# Altium schematic sheet INPUT_PWR_SW.SchDoc
size B; SheetNumber: 7; SheetTotal: 13
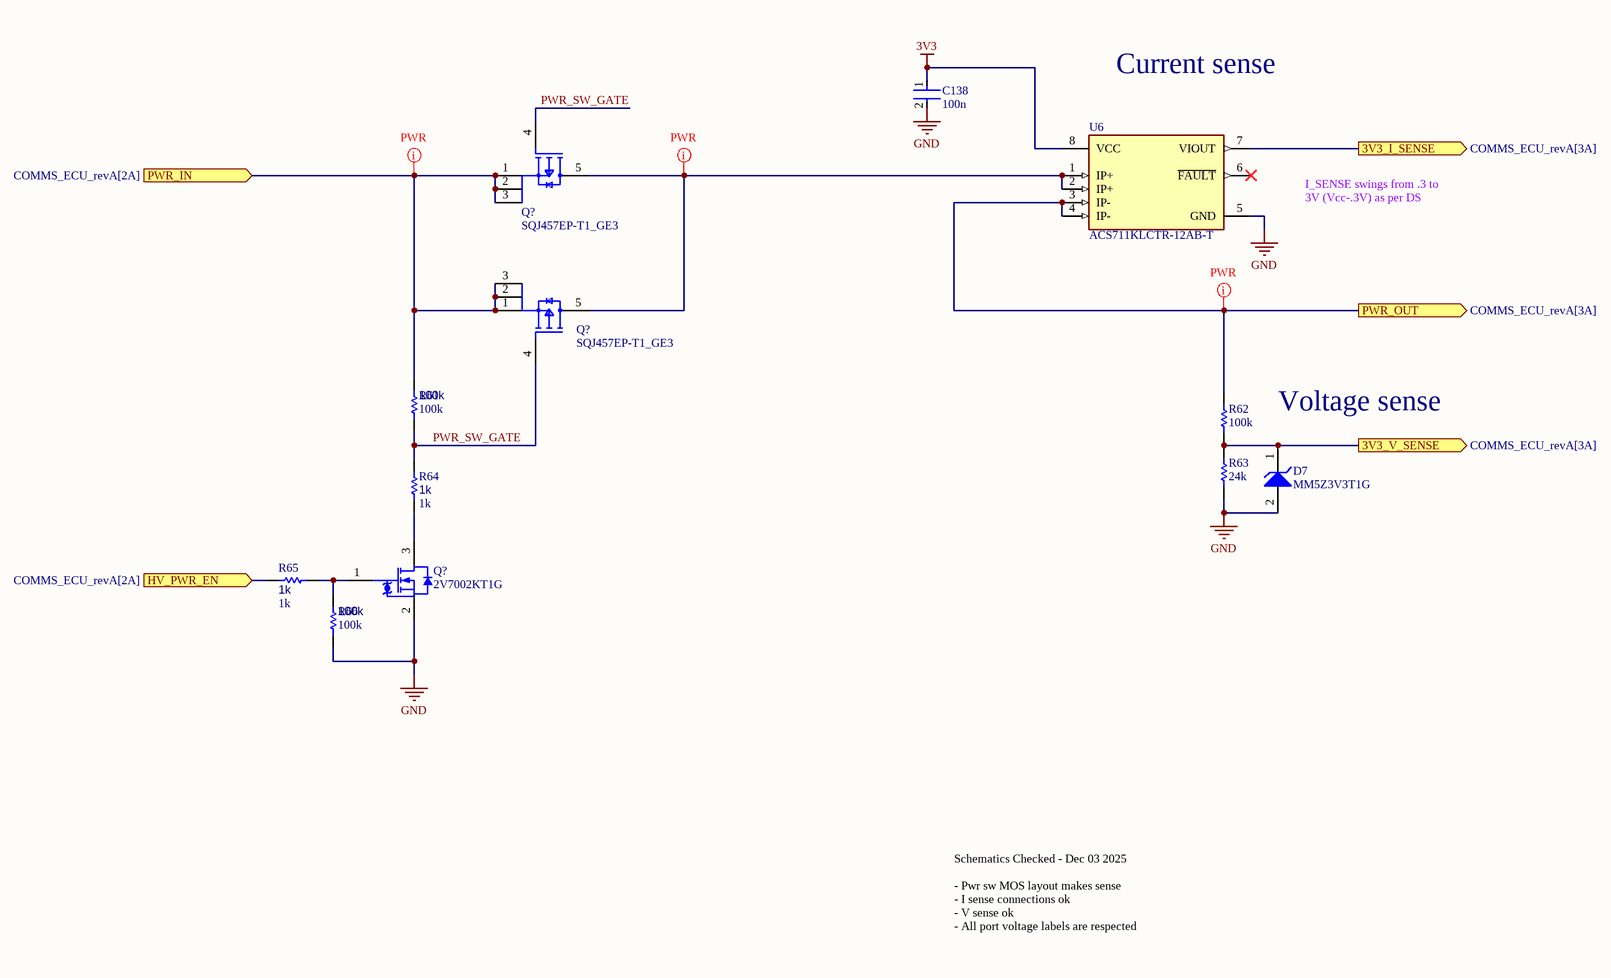
[diagram p0: INPUT_PWR_SW.SchDoc]

## Parts
(Parts that share a designator on the sheet are numbered #1, #2 ... from top to bottom, then left to right.)
C138  100n  [FP-0402-L_1_0_0_05-W_0_5-IPC_A]
D7  MM5Z3V3T1G  [ONSC-SOD-523-2-502-01_V]
Q?#1  SQJ457EP-T1_GE3  [FP-C15-1203-SINGLE-MFG]
Q?#2  SQJ457EP-T1_GE3  [FP-C15-1203-SINGLE-MFG]
Q?#3  2V7002KT1G  [ONSC-SOT-23-3-318-08_V]
R61  100k  [R0603B]
R62  100k  [R0603B]
R63  24k  [R0603B]
R64  1k  [R0603B]
R65  1k  [R0603B]
R66  100k  [R0603B]
U6  ACS711KLCTR-12AB-T  [FP-LC-8-IPC_C]

## Ports
3V3_I_SENSE (out, see COMMS_ECU_revA[3A]), 3V3_V_SENSE (out, see COMMS_ECU_revA[3A]), HV_PWR_EN (in, see COMMS_ECU_revA[2A]), PWR_IN (in, see COMMS_ECU_revA[2A]), PWR_OUT (out, see COMMS_ECU_revA[3A])

## Nets
3V3: C138.1 U6.8(VCC)
GND: C138.2 D7.2(A) Q?#3.2(S) R63.1 R66.1 U6.5(GND)
3V3_I_SENSE: U6.7(VIOUT) ; port 3V3_I_SENSE
3V3_V_SENSE: D7.1(K) R62.1 R63.2 ; port 3V3_V_SENSE
HV_PWR_EN: R65.1 ; port HV_PWR_EN
PWR_IN: Q?#1.1(S) Q?#1.2(S) Q?#1.3(S) Q?#2.1(S) Q?#2.2(S) Q?#2.3(S) R61.2 ; port PWR_IN
PWR_OUT: R62.2 U6.3(IP-) U6.4(IP-) ; port PWR_OUT
PWR_SW_GATE: Q?#1.4(G) Q?#2.4(G) R61.1 R64.2
NetQ?#1_5: Q?#1.5(D) Q?#2.5(D) U6.1(IP+) U6.2(IP+)
NetQ?#3_1: Q?#3.1(G) R65.2 R66.2
NetQ?#3_3: Q?#3.3(D) R64.1

Not connected (* = marked no-connect by the designer): U6 6(~{FAULT})*

## Layout directives
net class PWR: NetQ?#1_5, PWR_IN, PWR_OUT

## Notes on the sheet
- Current sense
- I_SENSE swings from .3 to 3V (Vcc-.3V) as per DS
- Voltage sense
- Schematics Checked - Dec 03 2025
  - Pwr sw MOS layout makes sense
  - I sense connections ok
  - V sense ok
  - All port voltage labels are respected

## Library data of the parts
C138 = CMP-001-00058-1: LARGE PADS, 0402 CAP, CHANGE COMMENT TO MATCH REAL P/N; Capacitor Type: Ceramic; Min Operating Temperature: -55°C; Mounting Technology: Surface Mount; Pins: 2; Case/Package: 0402; RoHS Compliant: Yes; Max Operating Temperature: 85°C
D7 = CMP-1060-00750-1: Zener Voltage Regulator, 500 mW, 2-Pin SOD-523, Pb-Free, Tape and Reel; Manufacturer: On Semiconductor; P Max (W): 0.5; VZ Typ (V): 3.3; RoHS: Pb-Free; ComponentLink2Description: Datasheet; PackageReference: SOD-523-2-502-01; DatasheetVersion: Rev. 10; ComponentLink1Description: Manufacturer URL; PackageVersion: Rev. E, 09/2010; ComponentLink3URL: http://www.onsemi.com/pub_link/Collateral/502-01.PDF; ComponentLink2URL: http://www.onsemi.cn/pub_link/Collateral/MM5Z2V4T1-D.PDF; Mounting Technology: Surface Mount; PartNumber: MM5Z3V3T1G; Packing: Tape and Reel; PackageDescription: 2-Pin SOD, Body 1.2 x 0.8 mm; ComponentLink1URL: http://www.onsemi.com/; ComponentLink3Description: Package Specification
Q?#1 Q?#2 = CMP-02550-000177-1: MOSFET P-CH 60V 36A POWERPAKSO-8; Manufacturer: Vishay; Gate Charge At Vgs: 65nC @ -10V; Rthja Max: 68°C/W; Number Of P Channels: 1; Continuous Drain Current: -36A; Drain To Source Resistance: 0.021Ω; Depletion Mode: False; Threshold Vgs Max: -2.5V; Max Junction Temp: +175°C; Power Dissipation: 68W; Turn Off Delay Time: 40ns; Automotive Grade: Grade 0; Max Forward Diode Voltage: -1.2V; Pulse Drain Current: -100A; Gate To Source Voltage: 20V; Typ Forward Diode Voltage: -0.8V; Drain To Source Voltage: -60V; Standoff Height: 0mm; Transconductance: 26S; Turn On Delay Time: 15ns; Threshold Vgs Min: -1.5V; Input Capacitace At Vds: 2600pF @ -25V; Digikey Description: MOSFET P-CH 60V 36A POWERPAKSO-8; Temperature Range High: +175°C; Device Class L3: MOSFETs; Lead Free: Yes; ComponentLink2URL: http://www.vishay.com/docs/76628/sqj457ep.pdf; Mouser Description: Trans MOSFET P-CH 60V 36A Automotive 5-Pin(4+Tab) PowerPAK SO T/R; Package: C15-1203-SINGLE; ComponentLink2Description: Datasheet; RoHS: TRUE; Number Of Channels: 1; Drain To Source Breakdown Voltage: -60V; Automotive: Yes; Height: 1.267mm; Device Class L1: Discrete Semiconductors; Temperature: -55°C to +175°C; Temperature Range Low: -55°C; Category: Trans; Manufacturer Part Number: SQJ457EP-T1_GE3; Octopart: https://octopart.com/sqj457ep-t1_ge3-vishay-76967335; Device Class L2: Transistors
Q?#3 = CMP-1058-00784-1: Small Signal MOSFET, 60 V, 380 mA, Single, N-Channel, 3-Pin SOT-23, Pb-Free, Tape and Reel; Manufacturer: On Semiconductor; ID Max (A): 0.38; V(BR)DSS Min (V): 60; Coss Typ (pF): 4.2; VGS(th) Max (V): 2.3; Crss Typ (pF): 2.2; VGS Max (V): 20; Channel Polarity: N Channel; Ciss Typ (pF): 24.5; ComponentLink3URL: http://www.onsemi.cn/pub_link/Collateral/318-08.PDF; ComponentLink1Description: Manufacturer URL; Configuration: Single; Mounting Technology: Surface Mount; ComponentLink3Description: Package Specification; DatasheetVersion: Rev. 11; Packing: Tape and Reel; PackageVersion: Rev. AP, 11/2009; PackageReference: SOT-23-3-318-08; Package Type: SOT-23-3; ComponentLink2URL: http://www.onsemi.com/pub_link/Collateral/2N7002K-D.PDF; ComponentLink2Description: Datasheet; RoHS: Pb-Free; PackageDescription: 3-Pin Small Outline Transistor, Body 2.92 x 1.3 mm, Pitch 0.95 mm; ComponentLink1URL: http://www.onsemi.com/; PartNumber: 2V7002KT1G
R61-R66 = CMP-009-00002-14: Resistor
  R61 R62 R66: Value: 100k
  R63: Value: 24k
  R64 R65: Value: 1k
U6 = CMP-1557-00012-2: SENSOR CURRENT HALL 12.5A AC/DC; Number of Channels: 1; Min Supply Voltage: 3V; Sensitivity: 110mV/A; Response Time: 4.6us; Operating Supply Voltage: 3.3V; Max Supply Voltage: 5.5V; Max Supply Current: 5.5mA; Bandwidth: 100kHz; Linearity: 1%; Quiescent Current: 4mA; Accuracy: 5%; Polarity: Bidirectional; Case/Package: SOIC; Packaging: Tape and Reel; Number of Pins: 8; Width: 3.9mm; Frequency: 100kHz; -3db Bandwidth: 100kHz; REACH SVHC: No SVHC; Series: -; Height: 1.5mm; Package Quantity: 1; Min Operating Temperature: -40°C; Max Operating Temperature: 125°C; Current Sensing: 12.5A; RoHS Compliant: Yes; Length: 4.9mm